# Altium schematic sheet RS485.SchDoc
size A4
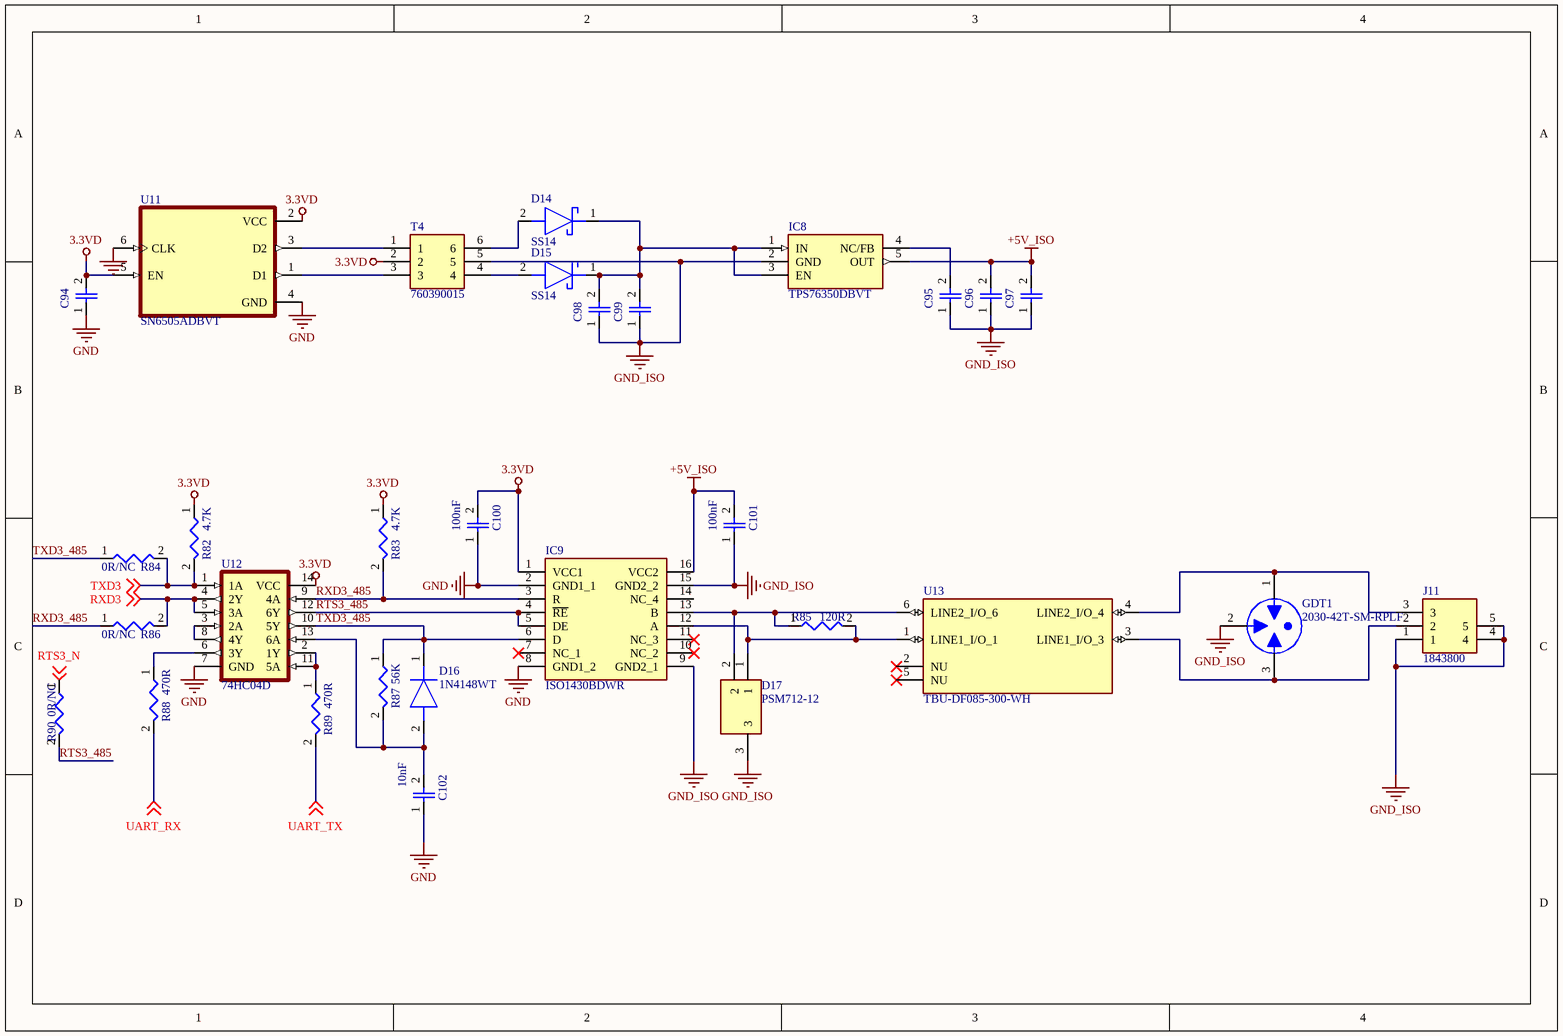
[diagram p0: RS485.SchDoc]

## Parts
C94  10uF,0805  [0805-C]  (value not drawn)
C95  10nF,0603/NC  [0603-C]  (value not drawn)
C96  10uF,0805  [0805-C]  (value not drawn)
C97  0.1uF,0603  [0603-C]  (value not drawn)
C98  10uF,0805  [0805-C]  (value not drawn)
C99  0.1uF,0603  [0603-C]  (value not drawn)
C100  100nF  [0603-C]
C101  100nF  [0603-C]
C102  10nF  [0603-C]
D14  SS14  [DIOM5127X261N]
D15  SS14  [DIOM5127X261N]
D16  1N4148WT  [SODFL1608X70N]
D17  PSM712-12  [PSM71212]
GDT1  2030-42T-SM-RPLF  [2030-42T-SM-RPLF]
IC8  TPS76350DBVT  [SOT95P280X145-5N]
IC9  ISO1430BDWR  [SOIC127P1030X265-16N]
J11  1843800  [1843800]
R82  4.7K  [0603-R]
R83  4.7K  [0603-R]
R84  0R/NC  [0603-R]
R85  120R  [0603-R]
R86  0R/NC  [0603-R]
R87  56K  [0603-R]
R88  470R  [0603-R]
R89  470R  [0603-R]
R90  0R/NC  [0603-R]
T4  760390015  [760390015]
U11  SN6505ADBVT  [SOT95P280X145-6N]
U12  74HC04D  [SOIC127P600X175-14N]
U13  TBU-DF085-300-WH  [IC_TBU-DF085-300-WH]

## Nets
3.3VD: C94.2 C100.2 IC9.1(VCC1) R82.1 R83.1 T4.2 U11.2(VCC) U11.5(EN) U12.14(VCC)
+5V_ISO: C96.2 C97.2 C101.2 IC8.5(OUT) IC9.16(VCC2)
GND: C94.1 C100.1 C102.1 IC9.2(GND1_1) IC9.8(GND1_2) U11.4(GND) U11.6(CLK) U12.7(GND)
GND_ISO: C95.1 C96.1 C97.1 C98.1 C99.1 C101.1 D17.3 GDT1.2(E) IC8.2(GND) IC9.9(GND2_1) IC9.15(GND2_2) J11.1 J11.4 J11.5 T4.5
RTS3_485: IC9.4(~{RE}) IC9.5(DE) R90.2 U12.12(6Y)
RTS3_N: R90.1 ; off-sheet RTS3_N
RXD3: R86.2 U12.4(2Y) U12.5(3A) ; off-sheet RXD3
RXD3_485: IC9.3(R) R83.2 R86.1 U12.9(4A)
TXD3: R82.2 R84.2 U12.1(1A) ; off-sheet TXD3
TXD3_485: D16.1(K) IC9.6(D) R84.1 R87.1 U12.10(5Y)
UART_RX: R88.2 ; off-sheet UART_RX
UART_TX: R89.2 ; off-sheet UART_TX
NetC95_2: C95.2 IC8.4(NC/FB)
NetC98_2: C98.2 C99.2 D14.1(K) D15.1(K) IC8.1(IN) IC8.3(EN)
NetC102_2: C102.2 D16.2(A) R87.2 U12.13(6A)
NetD14_2: D14.2(A) T4.6
NetD15_2: D15.2(A) T4.4
NetD17_1: D17.1 IC9.12(A) R85.2 U13.1(LINE1_I/O_1)
NetD17_2: D17.2 IC9.13(B) R85.1 U13.6(LINE2_I/O_6)
NetGDT1_1: GDT1.1(A) J11.3 U13.4(LINE2_I/O_4)
NetGDT1_3: GDT1.3(B) J11.2 U13.3(LINE1_I/O_3)
NetR88_1: R88.1 U12.6(3Y)
NetR89_1: R89.1 U12.2(1Y) U12.11(5A)
NetT4_1: T4.1 U11.3(D2)
NetT4_3: T4.3 U11.1(D1)
NetU12_3: U12.3(2A) U12.8(4Y)

Not connected (* = marked no-connect by the designer): IC9 7(NC_1)* 10(NC_2)* 11(NC_3)* 14(NC_4); U13 2(NU)* 5(NU)*

## Library data of the parts
C94-C102 = CAP
D14 D15 = SS14: Schottky Diode; Manufacturer_Name: MULTICOMP; Datasheet Link: https://componentsearchengine.com/Datasheets/2/SS14.pdf; Height: 2.61mm; Manufacturer_Part_Number: SS14
D16 = 1N4148WT: Diode; Manufacturer_Name: SEMTECH; Datasheet Link: https://datasheet.lcsc.com/szlcsc/Semtech-1N4148WT_C27748.pdf; Height: 0.7mm; Manufacturer_Part_Number: 1N4148WT
D17 = PSM712-12: TVS Diode (Bi-directional); Manufacturer_Name: ProTek Devices; Datasheet Link: http://www.protekdevices.com/xyz/documents/datasheets/psm712.pdf; Height: 1.21mm; Manufacturer_Part_Number: PSM712-12
GDT1 = 2030-42T-SM-RPLF: Gas Discharge Tube 90V 10000A _10kA_ 3 Pole Through Hole; MF: Littelfuse Inc.; MP: SL1021A090R; Value: *; Availability: Unavailable; Package: Axial Cylinder Littelfuse; Price: None; SnapEDA_Link: https://www.snapeda.com/parts/SL1021A090R/Littelfuse%20Inc./view-part/554396/?ref=snap
IC8 = TPS76350DBVT: Integrated Circuit; Manufacturer_Name: Texas Instruments; Datasheet Link: https://datasheet.datasheetarchive.com/originals/distributors/SFDatasheet-6/sf-000132493.pdf; Height: 1.45mm; Manufacturer_Part_Number: TPS76350DBVT; Mouser Part Number: 595-TPS76350DBVT; Mouser Price/Stock: https://www.mouser.co.uk/ProductDetail/Texas-Instruments/TPS76350DBVT?qs=8yeEWhuAOtP%2FFGo0oRuSfA%3D%3D; Arrow Part Number: TPS76350DBVT; Arrow Price/Stock: https://www.arrow.com/en/products/tps76350dbvt/texas-instruments?region=nac
IC9 = ISO1430BDWR: Integrated Circuit; Manufacturer_Name: Texas Instruments; Datasheet Link: http://www.ti.com/lit/gpn/ISO1430; Height: 2.65mm; Manufacturer_Part_Number: ISO1430BDWR; Mouser Part Number: 595-ISO1430BDWR; Mouser Price/Stock: https://www.mouser.co.uk/ProductDetail/Texas-Instruments/ISO1430BDWR?qs=EBDBlbfErPz8lerRTXnR0w%3D%3D; Arrow Part Number: ISO1430BDWR; Arrow Price/Stock: https://www.arrow.com/en/products/iso1430bdwr/texas-instruments?region=nac
J11 = 1843800: Connector; Manufacturer_Name: Phoenix Contact; Datasheet Link: http://www.phoenixcontact.com/de/produkte/1843800/pdf; Height: 7.4mm; Manufacturer_Part_Number: 1843800; Mouser Part Number: 651-1843800; Mouser Price/Stock: https://www.mouser.co.uk/ProductDetail/Phoenix-Contact/1843800?qs=uJX40y%252BSWqgV2WPXXVa%2FDw%3D%3D; Arrow Part Number: 1843800; Arrow Price/Stock: https://www.arrow.com/en/products/1843800/phoenix-contact?region=nac
R82-R90 = Res
T4 = 760390015: Transformer; Manufacturer_Name: Wurth Elektronik; Datasheet Link: https://www.we-online.com/components/products/datasheet/760390015.pdf; Manufacturer_Part_Number: 760390015; Mouser Part Number: 710-760390015; Mouser Price/Stock: https://www.mouser.co.uk/ProductDetail/Wurth-Elektronik/760390015?qs=wElim4iM2pjOQCmk%252B8YbFA%3D%3D
U11 = SN6505ADBVT: Low-noise, 1-A, 160-kHz transformer driver with soft start for isolated power supplies 6-SOT-23 -55 to 125; MF: Texas Instruments; Texas_Instruments-Purchase-URL: https://snapeda.com/shop?store=Texas+Instruments&id=779078; Value: *; Availability: Unavailable; SnapEDA_Link: https://www.snapeda.com/parts/SN6505ADBVT/Texas%20Instruments/view-part/779078/?ref=snap; Package: SOT-23-6 Texas Instruments; MP: SN6505ADBVT; Price: None; BuyPart: https://www.snapeda.com/parts/SN6505ADBVT/Texas%20Instruments/view-part/779078/?ref=eda
U12 = 74HC04D: Inverter IC 6 Channel 14-SOIC; MF: Toshiba; Value: *; MP: 74HC04D; Package: SOIC-14 NXP Semiconductors; Price: None; Availability: Unavailable; SnapEDA_Link: https://www.snapeda.com/parts/74HC04D/Toshiba%20Semiconductor%20and%20Storage/view-part/1040011/?ref=snap
U13 = TBU-DF085-300-WH: DUAL BI-DIR TBU 850V 300MA; MF: Bourns Inc.; SnapEDA_Link: https://www.snapeda.com/parts/TBU-DF085-300-WH/Bourns/view-part/?ref=snap; Availability: In Stock; Purchase-URL: https://pricing.snapeda.com/search/part/TBU-DF085-300-WH/?ref=eda; Check_prices: https://www.snapeda.com/parts/TBU-DF085-300-WH/Bourns/view-part/?ref=eda; Value: *; Package: TDFN-6 Bourns Inc.; MP: TBU-DF085-300-WH; Price: None